# Altium schematic sheet Copy of Power.SchDoc: =SheetTitle
size A4; CompanyName: Catcatcat Electronics; Engineer: Hena Chernov; SheetNumber: 6; SheetTotal: 11; CodePhone: +380505759863; SheetDescription: Description; Email: catcatcat.electronics@gmail.com
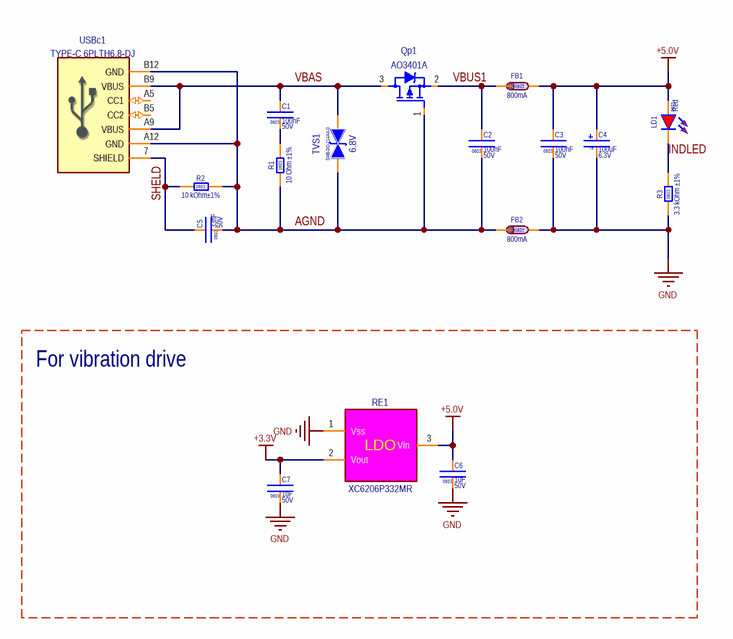
[diagram p0: Copy of Power.SchDoc]

## Parts
C1  value 100nF  Voltage: 50V  [CC0603(1608)x0.8]  (hidden comment: 100 nF ±10% 50V)
C2  value 100nF  Voltage: 50V  [CC0603(1608)x0.8]  (hidden comment: 100 nF ±10% 50V)
C3  value 100nF  Voltage: 50V  [CC0603(1608)x0.8]  (hidden comment: 100 nF ±10% 50V)
C4  value 100uF  Voltage: 6.3V  [TANTAL_B]  (hidden comment: 100UF 6.3V CASE-B_3528)
C5  value 33nF  Voltage: 50V  [CC0603]  (hidden comment: 33nF ±10% 50V)
C6  value 1uF  Voltage: 50V  [CC0603(1608)x0.8]  (hidden comment: 1uF ±10% 50V 0603)
C7  value 1uF  Voltage: 50V  [CC0603(1608)x0.8]  (hidden comment: 1uF ±10% 50V 0603)
FB1  value 800mA  [FB0805(2012)]  (hidden comment: GZ2012D101TF)
FB2  value 800mA  [FB0805(2012)]  (hidden comment: GZ2012D101TF)
LD1  value Red  Case/Package: 0603  [LD0603 RED]  (hidden comment: KT-0603R)
Qp1  AO3401A  [FP-SOT23-IPC_A]
R1  value 10 Ohm ±1%  [RC0603(1608) -1%]  (hidden comment: 10R ±1% 0603)
R2  value 10 kOhm±1%  [RC0603(1608) -1%]  (hidden comment: 10K ±1% 0603)
R3  value 3.3 kOhm ±1%  [RC0603(1608) -1%]  (hidden comment: 3.3K ±1% 0603)
RE1  XC6206P332MR  [SOT-23-3L]
TVS1  value 6.8V  Case/Package: SMB-DO-214AA-0  [SMB/DO-214AA]  (hidden comment: P6SMB6.8CA)
USBc1  TYPE-C 6PLTH6.8-DJ  [YTC-TC6-555]

## Blocks framed on the sheet
For vibration drive: C6 C7 RE1

## Nets
+3.3V: C7.2 RE1.2(Vout)
+5.0V: C3.2 C4.1 C6.2 FB1.2 LD1.2 RE1.3(Vin)
GND: C3.1 C4.2 C6.1 C7.1 FB2.2 R3.1 RE1.1(Vss)
AGND: C2.1 C5.1 FB2.1 Qp1.1(G) R1.1 R2.2 TVS1.1 USBc1.A12(GND) USBc1.B12(GND)
INDLED: LD1.1 R3.2
SHELD: C5.2 R2.1 USBc1.7(SHIELD)
VBAS: C1.2 Qp1.3(D) TVS1.2 USBc1.A9(VBUS) USBc1.B9(VBUS)
VBUS1: C2.2 FB1.1 Qp1.2(S)
NetC1_1: C1.1 R1.2

Not connected (* = marked no-connect by the designer): USBc1 A5(CC1) B5(CC2)

## Notes on the sheet
- Project Title:
- Project Version:
- Designed for:
- Lead Project
- Project ID:
- Development company
- Date:
- PCB Revision:
- PCB Name:
- Sheet Title:
- Assembly Variant:
- Time:
- Sheet
- of
- Engineer SCH:
- Engineer PCB:
- Inspection PRJ:
- Size: A4
- File:
- (in symbol TANTAL-B 100uF 6.3V (B)) TB
- (in symbol XC6206P332MR (B)) LDO

## Library data of the parts
C1-C3 = 0603 0.1 uF (B): 100 nF ±10% 50V X7R; Manufacturer 1: YAGEO; Manufacturer Part Number 1: CC0603KRX7R9BB104; Note: Ceramic Capacitors; Detailed Description: 50V 100nF X7R ±10% 0603  Multilayer Ceramic Capacitors MLCC - SMD/SMT ROHS; Case/Package: 0603; Publisher: Catcatcat Electronics; Tolerance: ±10%; HelpURL: https://datasheet.lcsc.com/lcsc/1809301912_YAGEO-CC0603KRX7R9BB104_C14663.pdf; website developer: http://catcatcat.d-lan.dp.ua/; Temperature Coefficient: X7R; Supplier URL 1: https://jlcpcb.com/parts/componentSearch?searchTxt=; Operating Temperature: -55C to +125C; Supplier Part Number 1: C14663; Supplier Unit Price 1: 0.0021; Assembly type: Basic Part; Footprint check status: Verified; QuantityElements: 1; Supplier 1: LCSC; MountType: SMD
C4 = TANTAL-B 100uF 6.3V (B): Tantalum Capacitors 100uF 6.3V CASE-B_3528 RoHS; Manufacturer 1: AVX; Manufacturer Part Number 1: TAJB107K006RNJ; Lifetime @ Temp: 2000Hrs@105℃; Case/Package: CASE-B_3528; Publisher: Catcatcat Electronics; Note: Tantalum Capacitors; HelpURL: https://datasheet.lcsc.com/szlcsc/AVX-TAJB107K006RNJ_C16133.pdf; website developer: http://catcatcat.d-lan.dp.ua/; Detailed Description: Tantalum Capacitors 100uF 6.3V CASE-B_3528 RoHS; Supplier URL 1: https://jlcpcb.com/parts/componentSearch?searchTxt=; Supplier Part Number 1: C16133; Supplier Unit Price 1: 0.1177; Assembly type: Basic Part; Footprint check status: Verified; QuantityElements: 1; Supplier 1: LCSC; MountType: SMD
C5 = 0603 0.033 uF (B): 33 nF ±10% 50V X7R; Manufacturer 1: Samsung Electro-Mechanics; Manufacturer Part Number 1: CL10B333KB8NNNC; Note: Ceramic Capacitors; Detailed Description: 50V 33nF X7R ±10% 0603  Multilayer Ceramic Capacitors MLCC - SMD/SMT ROHS; Case/Package: 0603; Publisher: Catcatcat Electronics; Tolerance: ±10%; HelpURL: https://datasheet.lcsc.com/lcsc/1810261514_Samsung-Electro-Mechanics-CL10B333KB8NNNC_C21117.pdf; website developer: http://catcatcat.d-lan.dp.ua/; Temperature Coefficient: X7R; Supplier URL 1: https://lcsc.com/product-detail/Multilayer-Ceramic-Capacitors-MLCC-SMD-SMT_SAMSUNG_CL10B223KB8NNNC_22nF-223-10-50V_C21122.html; Operating Temperature: -55C to +125C; Supplier Part Number 1: C21117; Supplier Unit Price 1: 0.0047; Assembly type: Basic Part; Footprint check status: Verified; QuantityElements: 1; Octopart: https://octopart.com/search?q=CL10B333KB8NNNC&currency=USD&specs=0; Supplier 1: LCSC; MountType: SMD
C6 C7 = 0603 1.0 uF (B): 1.0 uF ±10% 50V X5R; Manufacturer 1: Samsung Electro-Mechanics; Manufacturer Part Number 1: CL10A105KB8NNNC; Note: Ceramic Capacitors; Detailed Description: 50V 1uF X5R ±10% 0603  Multilayer Ceramic Capacitors MLCC - SMD/SMT ROHS; Case/Package: 0603; Publisher: Catcatcat Electronics; Tolerance: ±10%; HelpURL: https://datasheet.lcsc.com/szlcsc/Samsung-Electro-Mechanics-CL10A105KB8NNNC_C15849.pdf; Website Developer: http://catcatcat.d-lan.dp.ua/; Temperature Coefficient: X5R; Supplier URL 1: https://jlcpcb.com/parts/componentSearch?searchTxt=; Operating Temperature: -55C to +125C; Supplier Part Number 1: C15849; Supplier Unit Price 1: 0.0051; Assembly type: Basic Part; Footprint check status: Verified; QuantityElements: 1; Supplier 1: LCSC; MountType: SMD
FB1 FB2 = 0805 GZ2012D101TF (B): 0.80A 100 Ohm @100MHz 150 mOhm; Manufacturer 1: Sunlord; Note: Ferrite Beads and Chips; Detailed Description: BEADS 0805 ROHS; Impedance @ Frequency: 100±25%; Case/Package: 0805; Publisher: Catcatcat Electronics; HelpURL: https://datasheet.lcsc.com/szlcsc/Sunlord-GZ2012D101TF_C1015.pdf; website developer: http://catcatcat.d-lan.dp.ua/; Manufacturer Part Number 1: GZ2012D101TF; Supplier URL 1: https://jlcpcb.com/parts/componentSearch?searchTxt=; Supplier Part Number 1: C1015; Supplier Unit Price 1: 0.0116; Assembly type: Basic Part; Footprint check status: Verified; QuantityElements: 1; Supplier 1: LCSC; MountType: SMD
LD1 = KT-0603R (B): 0603 Red 520~625NM 90~100MCD@20MA Top View RoHS; Manufacturer 1: Hubei KENTO Elec; Note: LED Red; Temp.Characteristic: -40C to +85C; Detailed Description: -40℃~+85℃ Red 0603  Light Emitting Diodes (LED) ROHS; Millicandela Rating: 30~50mcd@5mA; Wavelength(Range or typical): 619~625nm; Publisher: Catcatcat Electronics; Manufacturer Part Number 1: KT-0603R; Supplier URL 1: https://www.lcsc.com/product-detail/Light-Emitting-Diodes-LED_Hubei-KENTO-Elec-KT-0603R_C2286.html; Supplier Part Number 1: C2286; Supplier Unit Price 1: 0.0041; HelpURL: https://datasheet.lcsc.com/szlcsc/Hubei-KENTO-Elec-KT-0603R_C2286.pdf; Website developer: http://catcatcat.d-lan.dp.ua/; Assembly type: Basic Part; Footprint check status: Verified; QuantityElements: 1; Supplier 1: LCSC; MountType: SMD
Qp1 = AO3401A (B): P-Channel SOT-23-3L 30V 4A 44mΩ@10V,4.3A 1.4W 1.3V@250uAl SOT-23-3L  MOSFETs ROHS; Manufacturer 1: Alpha & Omega Semicon; Note: Transistor; Temp.Characteristic: -40C to +85C; Voltage: 30V 4A; Detailed Description: MOSFET P TRENCH 30V 4A 1.3V @ 250UA 44 M? @ 4.3A,10V SOT-23-3L ROHS; Supplier Unit Price 1: 0.0863; Publisher: Catcatcat Electronics; Supplier URL 1: https://jlcpcb.com/parts/componentSearch?searchTxt=; HelpURL: https://datasheet.lcsc.com/szlcsc/Alpha-Omega-Semicon-AOS-AO3401A_C15127.pdf; Manufacturer Part Number 1: AO3401A; Website Developer: http://catcatcat.d-lan.dp.ua/; Case/Package: SOT-23-3L; Supplier Part Number 1: C15127; Assembly type: Basic Part; Footprint check status: Verified; QuantityElements: 1; Supplier 1: LCSC; MountType: SMD; Value: AO3401A
R1 = 0603 10 Ohm ±1% (B): 10 R (XIO) ±1% 1/10W 50V ±400ppm/°C; Manufacturer 1: Uniroyal Elec; Manufacturer Part Number 1: 0603WAF100JT5E; Note: Chip Resistor - Surface Mount; Detailed Description: 100mW Thick Film Resistors ±1% ±400ppm/℃ 10Ω 0603  Chip Resistor - Surface Mount ROHS; Publisher: Catcatcat Electronics; Tolerance: ±1%; Voltage: 50V; HelpURL: https://datasheet.lcsc.com/szlcsc/Uniroyal-Elec-0603WAF100JT5E_C22859.pdf; Website Developer: http://catcatcat.d-lan.dp.ua/; Temperature Coefficient: ±400ppm/°C; Power (Watts): 1/10W; Supplier URL 1: https://jlcpcb.com/parts/componentSearch?searchTxt=C22859; Operating Temperature: -55°C ~ 155°C; Supplier Part Number 1: C22859; Supplier Unit Price 1: 0.0009; Assembly type: Basic Part; Footprint check status: Verified; QuantityElements: 1; Supplier 1: LCSC; MountType: SMD; Case/Package: 0603
R2 = 0603 10 kOhm ±1% (B): 10 k (103) ±1% 1/10W; Manufacturer 1: Uniroyal Elec; Manufacturer Part Number 1: 0603WAF1002T5E; Voltage: 50V; Note: Chip Resistor - Surface Mount; Marking: 103; Temperature Coefficient: ±100ppm/°C; Detailed Description: CHIP RESISTOR - SURFACE MOUNT 10KOHMS ±1% 1/10W 0603 ROHS; Publisher: Catcatcat Electronics; Tolerance: ±1%; HelpURL: https://datasheet.lcsc.com/szlcsc/Uniroyal-Elec-0603WAF1002T5E_C25804.pdf; Website Developer: http://catcatcat.d-lan.dp.ua/; Power (Watts): 1/10W; Supplier URL 1: https://jlcpcb.com/parts/componentSearch?searchTxt=C25804; Operating Temperature: -55°C ~ 155°C; Supplier Part Number 1: C25804; Supplier Unit Price 1: 0.0008; Assembly type: Basic Part; Footprint check status: Verified; QuantityElements: 1; Supplier 1: LCSC; MountType: SMD; Case/Package: 0603
R3 = 0603 3.3 kOhm ±1% (B): 3.3 k (332) ±1% 1/10W 75V; Manufacturer 1: UNI-ROYAL(Uniroyal Elec); Note: Chip Resistor - Surface Mount; Temperature Coefficient: ±100ppm/℃; Detailed Description: ±1% 1/10W Thick Film Resistors 75V ±100ppm/℃ -55℃~+155℃ 3.3kΩ 0603 Chip Resistor - Surface Mount ROHS; Publisher: Catcatcat Electronics; Tolerance: ±1%; Voltage: 75V; HelpURL: https://datasheet.lcsc.com/lcsc/2110252130_UNI-ROYAL-Uniroyal-Elec-0603WAF3301T5E_C22978.pdf; Website Developer: http://catcatcat.d-lan.dp.ua/; Power (Watts): 1/10W; Supplier URL 1: https://jlcpcb.com/parts/componentSearch?searchTxt=; Manufacturer URL: http://uniohm.com/; Operating Temperature: -55°C ~ 155°C; Supplier Part Number 1: C22978; Supplier Unit Price 1: 0.0013; Assembly type: Basic Part; Footprint check status: Verified; QuantityElements: 1; Supplier 1: LCSC; MountType: SMD; Case/Package: 0603
RE1 = XC6206P332MR (B): LDO 5.0V 3.3V 200mA Fixed 3.3V~3.3V Positive 6V SOT-23-3L  Linear Voltage Regulators (LDO) ROHS; Manufacturer 1: Torex Semicon; Note: LOW DROPOUT REGULATORS(LDO); Marking: 662V; Voltage - Input (Min)/(Max): 5V; Supplier URL 1: https://jlcpcb.com/parts/componentSearch?searchTxt=C5446; Case/Package: SOT-23-3L; Supplier Part Number 1: C5446; Operating Temperature: -40C to +85C; Voltage: 3.3V; HelpURL: https://eu.mouser.com/datasheet/2/760/TOSL_S_A0007229533_1-2575067.pdf; Manufacturer Part Number 1: XC6206P332MR; Detailed Description: 200mA Fixed 3.3V~3.3V Positive 6V SOT-23-3L  Linear Voltage Regulators (LDO) ROHS; Supplier Unit Price 1: 0.0992; Publisher: Catcatcat Electronics; Website developer: http://catcatcat.d-lan.dp.ua/; Assembly type: Basic Part; Footprint check status: Verified; Current - Output (Max): 200mA; QuantityElements: 1; Supplier 1: LCSC; MountType: SMD; Value: XC6206P332MR
TVS1 = P6SMB6.8CA (B): TVS 6.8V SMB(DO-214AA) ROHS; Manufacturer 1: Brightking Elec (TAIWAN); Temp.Characteristic: -40C to +85C; Note: Diode; Marking: 6V8C; Detailed Description: TVS SMB(DO-214AA) ROHS; Publisher: Catcatcat Electronics; Voltage: 6.8V; HelpURL: https://datasheet.lcsc.com/szlcsc/Brightking-Elec-TAIWAN-P6SMB6-8CA_C78395.pdf; Manufacturer Part Number 1: P6SMB6.8CA; Website developer: http://catcatcat.d-lan.dp.ua/; Supplier URL 1: https://jlcpcb.com/parts/componentSearch?searchTxt=; Supplier Part Number 1: C78395; Supplier Unit Price 1: 0.0531; Assembly type: Extended Part; Footprint check status: Verified; QuantityElements: 1; Supplier 1: LCSC; MountType: SMT
USBc1 = TYPE-C 6PLTH6.8-DJ (E): Type C V USB 2.0 6P 3A Power Connectors ROHS; Manufacturer 1: SHOU HAN; Note: USB Connectors RoHS; Temp.Characteristic: -20C to +70C; Voltage: 20V 3A; Detailed Description: 3A 1 Brick nogging 6P Female -25℃~+85℃ Type-C SMD  USB Connectors ROHS; HelpURL: https://datasheet.lcsc.com/lcsc/2209011730_SHOU-HAN-TYPE-C-6PLTH6-8-DJ_C5156600.pdf; Publisher: Catcatcat Electronics; Manufacturer Part Number 1: TYPE-C 6PLTH6.8-DJ; Website developer: http://catcatcat.d-lan.dp.ua/; Assembly type: Extended Part; Supplier URL 1: https://www.lcsc.com/product-detail/USB-Connectors_SHOU-HAN-TYPE-C-6PLTH6-8-DJ_C5156600.html; Case/Package: SMD USB - Type C; Supplier Part Number 1: C5156600; Supplier Unit Price 1: 0.0495; Footprint check status: Verified; QuantityElements: 1; Supplier 1: LCSC; MountType: SMD-TH; Value: TYPE-C 6PLTH6.8-DJ